# EAGLE design Rocket_Ready (EAGLE 6.2)
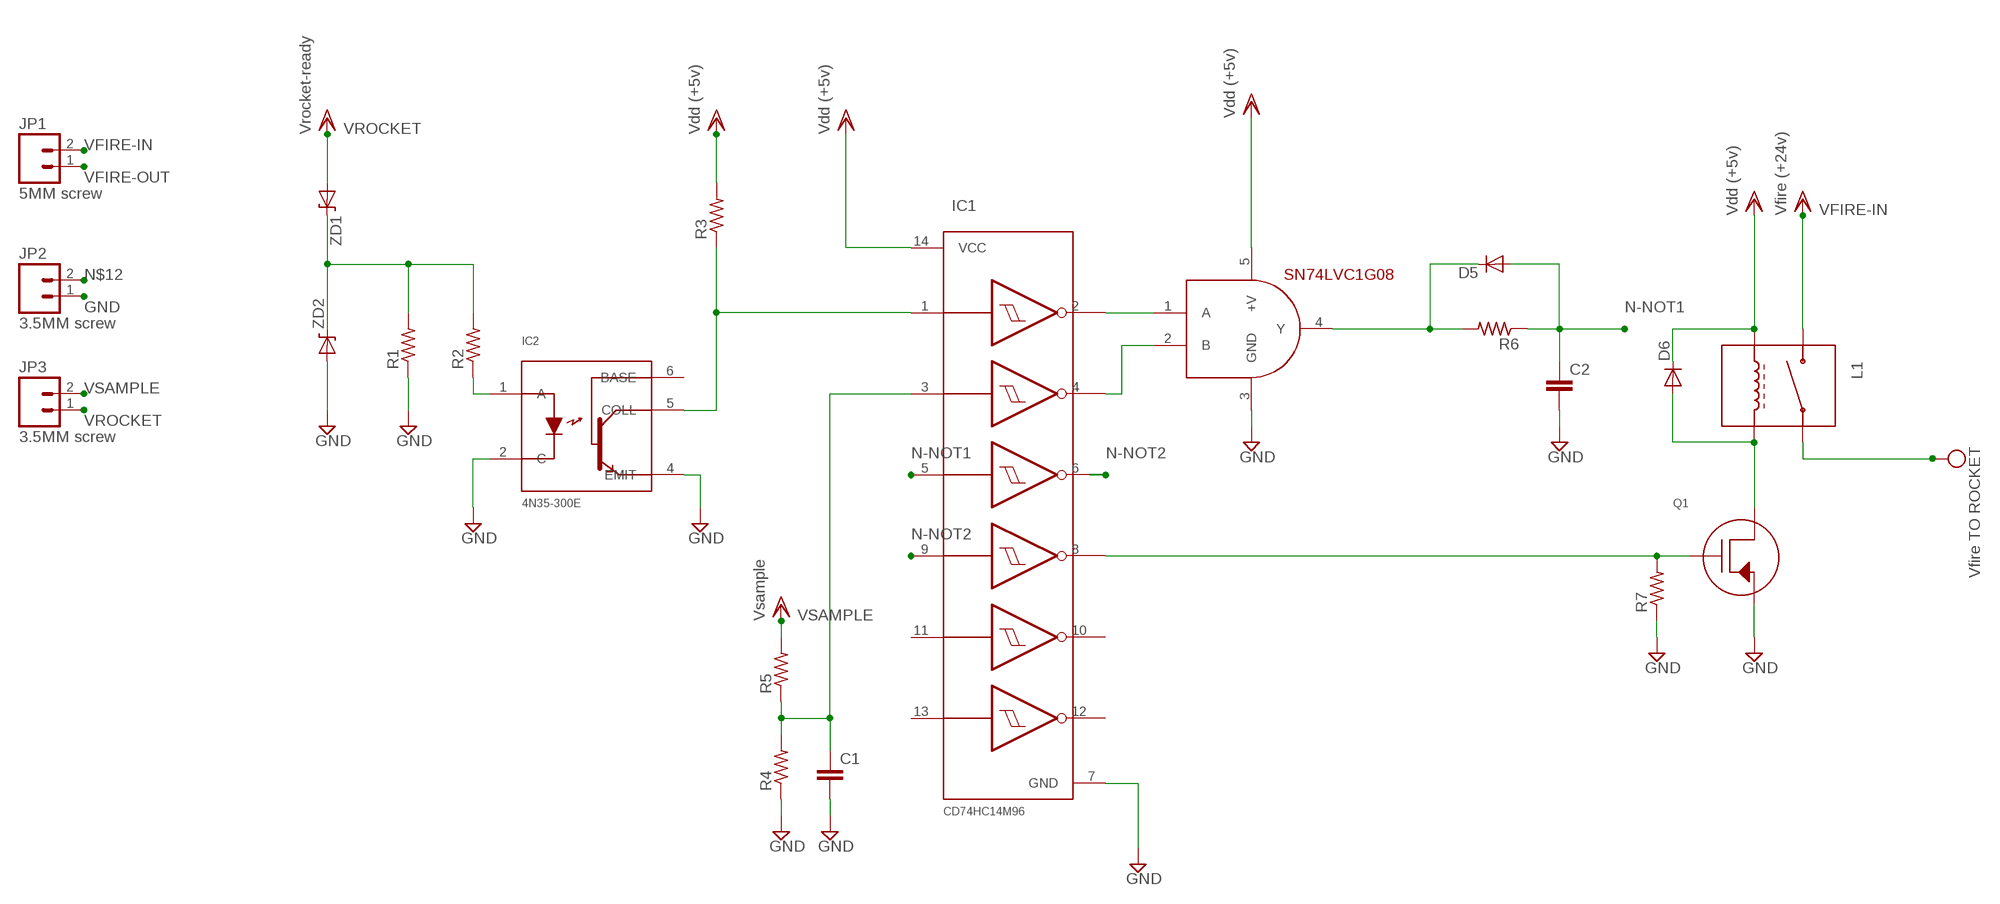
[diagram p0: schematic, sheet 1]

## Parts
C1  C-EU0805-B-NOSILK  [0805-B-NOSILK]
C2  C-EU0805-B-NOSILK  [0805-B-NOSILK]
D5  DIODEPTH  [DIODE-1N4001]
D6  DIODEPTH  [DIODE-1N4001]
IC1  INVERT GATES  HEX_INV_SHMITT_TRIG  [INVERTSOIC14]
IC2  OPTOISOLATOR  [4N35-300E]
JP1  5MM screw  M025MM  [SCREWTERMINAL-5MM-2]
JP2  3.5MM screw  M023.5MM  [SCREWTERMINAL-3.5MM-2]
JP3  3.5MM screw  M023.5MM  [SCREWTERMINAL-3.5MM-2]
L1  RELAY  [G5T-1A]
Q1  NMOSFET  [FETSO-8]
R1  R-US_0805-B-NOSILK  [0805-B-NOSILK]
R2  R-US_0805-B-NOSILK  [0805-B-NOSILK]
R3  R-US_0805-B-NOSILK  [0805-B-NOSILK]
R4  R-US_0805-B-NOSILK  [0805-B-NOSILK]
R5  R-US_0805-B-NOSILK  [0805-B-NOSILK]
R6  R-US_0805-B-NOSILK  [0805-B-NOSILK]
R7  R-US_0805-B-NOSILK  [0805-B-NOSILK]
U$1  AND GATE  SN74LVC1G08  [SOT23-5]
ZD1  DIODE-ZENERPTH  [DIODE-ZENER]
ZD2  DIODE-ZENERPTH  [DIODE-ZENER]

## Nets
GND: C1.2 C2.2 IC1.7(GND) IC2.2(C) IC2.4(EMIT) JP2.1 Q1.1(SOURCE) R1.1 R4.1 R7.1 U$1.3(GND) ZD2.P$2(A)
N$1: IC1.4(2Y) U$1.2(B)
N$2: D5.C R6.2 U$1.4(Y)
N$3: IC1.1(1A) IC2.5(COLL) R3.1
N$5: IC1.2(1Y) U$1.1(A)
N$6: IC2.1(A) R2.1
N$7: C1.1 IC1.3(2A) R4.2 R5.1
N$8: R1.2 R2.2 ZD1.P$1(C) ZD2.P$1(C)
N$9: D6.A L1.CIN Q1.5(DRAIN)
N$10: IC1.8(4Y) Q1.4(GATE) R7.2
N$12: D6.C IC1.14(VCC) JP2.2 L1.COUT R3.2 U$1.5(+V) ; supply symbol labelled Vdd (+5v)
N-NOT1: C2.1 D5.A IC1.5(3A) R6.1
N-NOT2: IC1.6(3Y) IC1.9(4A)
VFIRE-IN: JP1.2 L1.SW2 ; supply symbol labelled Vfire (+24v)
VFIRE-OUT: JP1.1 L1.SW1 ; supply symbol labelled Vfire TO ROCKET
VROCKET: JP3.1 ZD1.P$2(A) ; supply symbol labelled Vrocket-ready
VSAMPLE: JP3.2 R5.2 ; supply symbol labelled Vsample
Unconnected: IC1.10(5Y) IC1.11(5A) IC1.12(6Y) IC1.13(6A) IC2.6(BASE)

## Library data of the parts
C1 C2 = rcl_custom:C-EU: CAPACITOR, European symbol
D5 D6 = SparkFun:DIODE: Diode These are standard reverse protection diodes and small signal diodes. SMA package can handle up to about 1A. SOD-323 can handle about 200mA. What the SOD-323 package when ordering, there are some mfgs out there that are 5-pin packages.
IC1 = launch-tower:HEX_INV_SHMITT_TRIG: Single Schmitt-Trigger Inverter Gate
IC2 = launch-tower:OPTOISOLATOR
JP1-JP3 = SparkFun:M02: Header 2 Standard 2-pin 0.1" header. Use with straight break away headers (SKU : PRT-00116), right angle break away headers (PRT-00553), swiss pins (PRT-00743), machine pins (PRT-00117), and female headers (PRT-00115). Molex polarized connector foot print use with SKU : PRT-08233 with associated crimp pins and housings.
L1 = launch-tower:RELAY: FILTER pre-adjusted RF filter, type K, standard value E-12
Q1 = launch-tower:NMOSFET
R1-R7 = rcl_custom:R-US_: RESISTOR, American symbol
U$1 = SparkFun:SN74LVC1G08
ZD1 ZD2 = SparkFun:DIODE-ZENER: Zener Diode Production Part - 8199 3.4V Zener Voltage

## Board
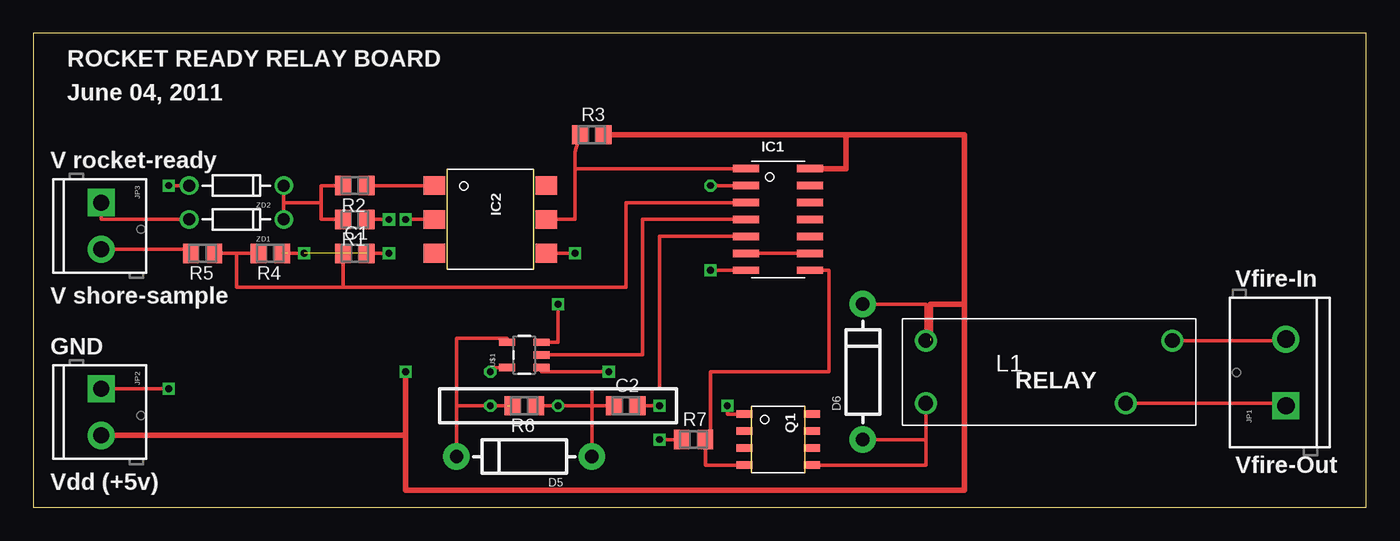
[diagram p1: board, top side]
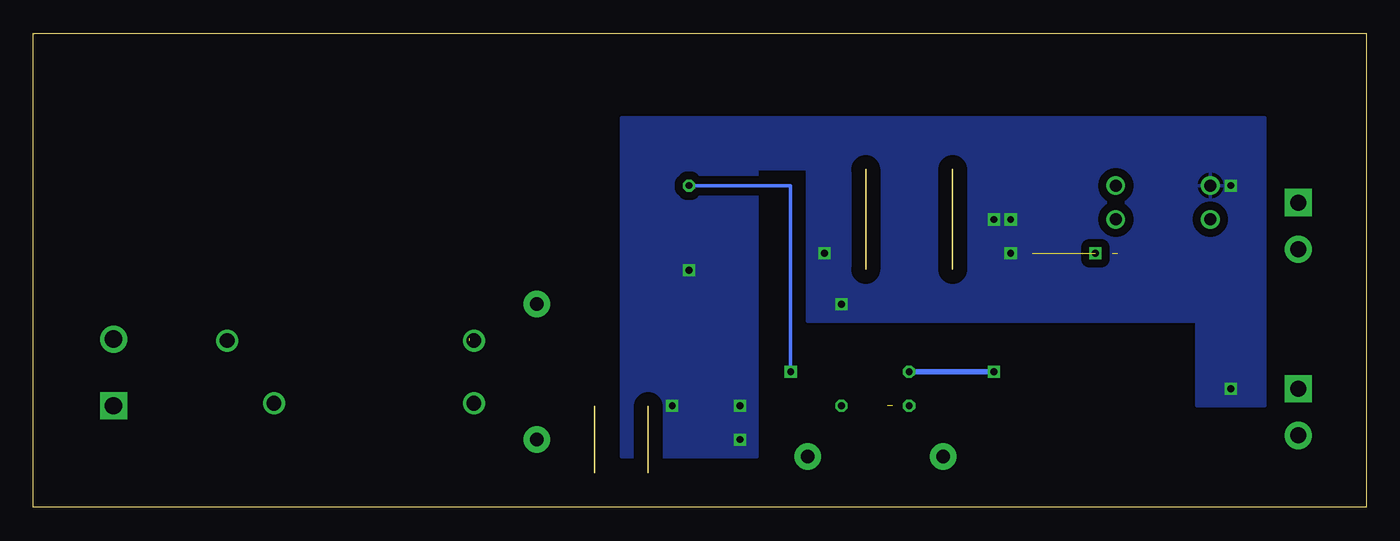
[diagram p2: board, bottom side, seen from below]

Size 100 x 35.55 mm. Coordinates in mm from the lower left corner, seen from the top.
Outline: 0,0 100,0 100,35.55 0,35.55 0,0
Copper layers (1*16): Top 0.035mm / dielectric 1.5mm / Bottom 0.035mm
Design rules: minimum track width 10mil, minimum drill 24mil, track to track 8mil, track to pad 8mil, pad to pad 8mil, via to via 8mil, smd to smd 8mil, copper to edge 40mil, drill to drill 8mil, minimum pad ring 10mil, minimum via ring 8mil, stop-mask expansion 4mil, vias tented up to drill 0mil, thermal gap 10mil

### Footprints (pad centres in the part's own frame; a part is rotated, then mirrored left to right if it is on the bottom)
0805-B-NOSILK = smd 1.15 x 1.45: 1 -0.9,0; 2 0.9,0
DIODE-1N4001 = drill 1 pad 1.981: A -5.08,0; C 5.08,0
INVERTSOIC14 = smd 0.55 x 1.95: 1 -3.81,-2.4; 2 -2.54,-2.4; 3 -1.27,-2.4; 4 0,-2.4; 5 1.27,-2.4; 6 2.54,-2.4; 7 3.81,-2.4; 8 3.81,2.4; 9 2.54,2.4; 10 1.27,2.4; 11 0,2.4; 12 -1.27,2.4; 13 -2.54,2.4; 14 -3.81,2.4
4N35-300E = smd 1.4 x 1.6: 1 -2.54,-4.2; 2 0,-4.2; 3 2.54,-4.2; 4 2.54,4.2; 5 0,4.2; 6 -2.54,4.2
SCREWTERMINAL-5MM-2 = drill 1.3 pad 2.032 square: 1 0,0 | drill 1.3 pad 2.032: 2 5,0
SCREWTERMINAL-3.5MM-2 = drill 1.2 pad 2.032 square: 1 0,0 | drill 1.2 pad 2.032: 2 3.5,0
G5T-1A = drill 1.1: CIN -9.25,-2.35; COUT -9.25,2.35; SW1 5.75,-2.35; SW2 9.25,2.35
FETSO-8 = smd 0.559 x 1.194: 1 -1.905,-2.527; 2 -0.635,-2.527; 3 0.635,-2.527; 4 1.905,-2.527; 5 1.905,2.527; 6 0.635,2.527; 7 -0.635,2.527; 8 -1.905,2.527
SOT23-5 = smd 0.55 x 1.2: 1 -0.95,-1.3; 2 0,-1.3; 3 0.95,-1.3; 4 0.95,1.3; 5 -0.95,1.3
DIODE-ZENER = drill 0.9: P$1 -3.556,0; P$2 3.556,0

### Placement (x,y rotation side)
C1  24.13,19.05 0 top
C2  44.45,7.62 0 top
D5  36.83,3.81 180 top
D6  62.23,10.16 90 top
IC1  55.88,21.59 270 top
IC2  34.29,21.59 270 top
JP1  93.98,7.62 90 top
JP2  5.08,8.89 270 top
JP3  5.08,22.86 270 top
L1  76.2,10.16 0 top
Q1  55.88,5.08 270 top
R1  24.13,21.59 180 top
R2  24.13,24.13 180 top
R3  41.91,27.94 0 top
R4  17.78,19.05 180 top
R5  12.7,19.05 180 top
R6  36.83,7.62 180 top
R7  49.53,5.08 0 top
U$1  36.83,11.43 90 top
ZD1  15.24,21.59 180 top
ZD2  15.24,24.13 180 top

### Tracks (layer width: path | path; a pad name or v marks a point on that pad's centre or on a via)
GND  (via drill 0.51)  (2 unrouted)
  Top 0.254: v26.67,19.05 C1.2 | IC1.7 v50.8,17.78 | JP2.1 v10.16,8.89 | C2.2 v46.99,7.62 | IC2.4 v40.64,19.05 | U$1.3 39.37,12.38 v39.37,15.24 | Q1.1 52.07,6.99 v52.07,7.62 | R7.1 v46.99,5.08 | IC2.2 v27.94,21.59 | ZD2.P$2 v10.16,24.13 | v26.67,21.59 R1.1 | 20.32,19.05 19.05,19.05
  pour Bottom (isolate 0.61): 41.91,25.4 41.91,13.97 12.7,13.97 12.7,7.62 7.62,7.62 7.62,29.21 55.88,29.21 55.88,3.81 45.72,3.81 45.72,25.4
N$1
  Top 0.254: IC1.4 45.72,21.59 45.72,11.43 U$1.2
N$2  (via drill 0.51)  (1 unrouted)
  Top 0.254: D5.C 31.75,7.62 | 31.75,7.62 31.75,12.7 35.53,12.7 U$1.4 | 35.56,7.62 v34.29,7.62 31.75,7.62
N$3
  Top 0.254: IC2.5 40.64,21.59 40.64,25.4 | 40.64,25.4 40.64,26.67 R3.1 | IC1.1 40.64,25.4
N$4  (via drill 0.51)
  other vias: 20.32,19.05
N$5  (via drill 0.51)
  Top 0.254: IC1.2 v50.8,24.13 | v43.18,10.16 38.13,10.16 U$1.1
  Bottom 0.254: v50.8,24.13 43.18,24.13 v43.18,10.16
N$6
  Top 0.254: R2.1 IC2.1
N$7
  Top 0.254: R5.1 15.24,19.05 | 15.24,19.05 R4.2 | 23.23,16.51 C1.1 | 15.24,19.05 15.24,16.51 20.32,16.51 23.23,16.51 | 23.23,16.51 44.45,16.51 44.45,22.86 IC1.3
N$8
  Top 0.254: ZD2.P$1 18.8,22.86 | R2.2 21.59,24.13 21.59,22.86 | 21.59,22.86 21.59,21.59 R1.2 | ZD1.P$1 18.8,22.86 | 18.8,22.86 21.59,22.86
N$9
  Top 0.254: Q1.5 66.95,3.17 L1.CIN 66.95,5.08 D6.A
N$10
  Top 0.254: Q1.4 50.43,3.17 R7.2 50.8,5.08 50.8,10.16 59.69,10.16 59.69,17.78 IC1.8
N$12  (via drill 0.51)  (1 unrouted)
  Top 0.254: 67.31,12.51 L1.COUT 66.95,15.24 D6.C | U$1.5 34.29,10.48 v34.29,10.16
  Top 0.406: 67.31,12.7 67.31,15.24 69.85,15.24 | v27.94,10.16 27.94,5.39 | 27.94,5.39 27.94,1.27 69.85,1.27 69.85,15.24 | R3.2 60.96,27.94 | 60.96,27.94 69.85,27.94 69.85,15.24 | IC1.14 60.96,25.4 60.96,27.94 | JP2.2 27.94,5.39
  Bottom 0.406: v34.29,10.16 v27.94,10.16
N-NOT1  (via drill 0.51)
  Top 0.254: R6.1 v39.37,7.62 41.91,7.62 | 41.91,7.62 C2.1 | D5.A 41.91,7.62 | IC1.5 46.99,20.32 46.99,8.89 41.91,8.89 41.91,7.62
N-NOT2
  Top 0.254: IC1.6 IC1.9
VFIRE-IN
  Top 0.254: L1.SW2 93.87,12.51 JP1.2
VFIRE-OUT
  Top 0.254: L1.SW1 93.79,7.81 JP1.1
VROCKET
  Top 0.254: JP3.1 5.08,21.59 ZD1.P$2
VSAMPLE
  Top 0.254: JP3.2 11.8,19.36 R5.2

### Text on the board
tPlace: ROCKET READY RELAY BOARD | June 04, 2011 | V rocket-ready | Vfire-In | V shore-sample | GND | RELAY | Vfire-Out | Vdd (+5v)